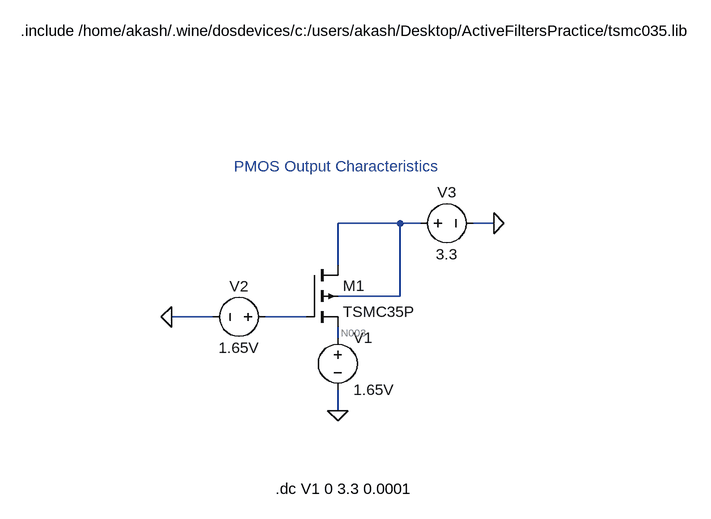
[diagram p0: schematic PMOS_Output_Characteristics.asc]
PMOS_Output_Characteristics.asc, the LTspice schematic file:
Version 4
SHEET 1 1260 4660
WIRE 496 0 400 0
WIRE 528 0 496 0
WIRE 640 0 608 0
WIRE 400 64 400 0
WIRE 496 112 496 0
WIRE 496 112 400 112
WIRE 208 144 144 144
WIRE 352 144 288 144
WIRE 400 176 400 160
WIRE 400 288 400 256
FLAG 400 288 0
FLAG 144 144 0
FLAG 640 0 0
SYMBOL pmos4 352 64 R0
SYMATTR InstName M1
SYMATTR Value TSMC35P
SYMATTR Value2 l=0.5u w=5u
SYMBOL voltage 400 160 R0
WINDOW 123 0 0 Left 0
WINDOW 39 0 0 Left 0
SYMATTR InstName V1
SYMATTR Value 1.65V
SYMBOL voltage 304 144 R90
WINDOW 0 -32 56 VBottom 2
WINDOW 3 32 56 VTop 2
WINDOW 123 0 0 Left 0
WINDOW 39 0 0 Left 0
SYMATTR InstName V2
SYMATTR Value 1.65V
SYMBOL voltage 512 0 R270
WINDOW 0 32 56 VTop 2
WINDOW 3 -32 56 VBottom 2
WINDOW 123 0 0 Left 0
WINDOW 39 0 0 Left 0
SYMATTR InstName V3
SYMATTR Value 3.3
TEXT 304 408 Left 2 !.dc V1 0 3.3 0.0001
TEXT -88 -296 Left 2 !.include /home/akash/.wine/dosdevices/c:/users/akash/Desktop/ActiveFiltersPractice/tsmc035.lib
TEXT 240 -88 Left 2 ;PMOS Output Characteristics

The netlist it stands for:
* PMOS_Output_Characteristics.asc
M1 N001 N002 N003 N001 TSMC35P l=0.5u w=5u
V1 N003 0 1.65V
V2 N002 0 1.65V
V3 N001 0 3.3
.model NMOS NMOS
.model PMOS PMOS
.lib standard.mos
.dc V1 0 3.3 0.0001
.include /home/akash/.wine/dosdevices/c:/users/akash/Desktop/ActiveFiltersPractice/tsmc035.lib
* PMOS Output Characteristics
.backanno
.end

* Results of the author's LTspice run, read from the files saved beside the schematic
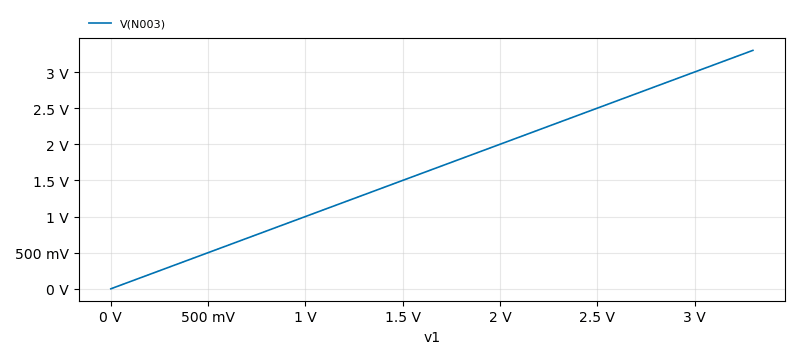
[diagram p1: DC transfer characteristic of PMOS_Output_Characteristics.asc, plotted from the saved traces]
* DC transfer characteristic, 1 run:
*   V(N003): 0 V at v1=0 V, 3.3 V at v1=3.3 V, min 0 V, max 3.3 V